# Altium schematic sheet LedModulePower.SchDoc
size B
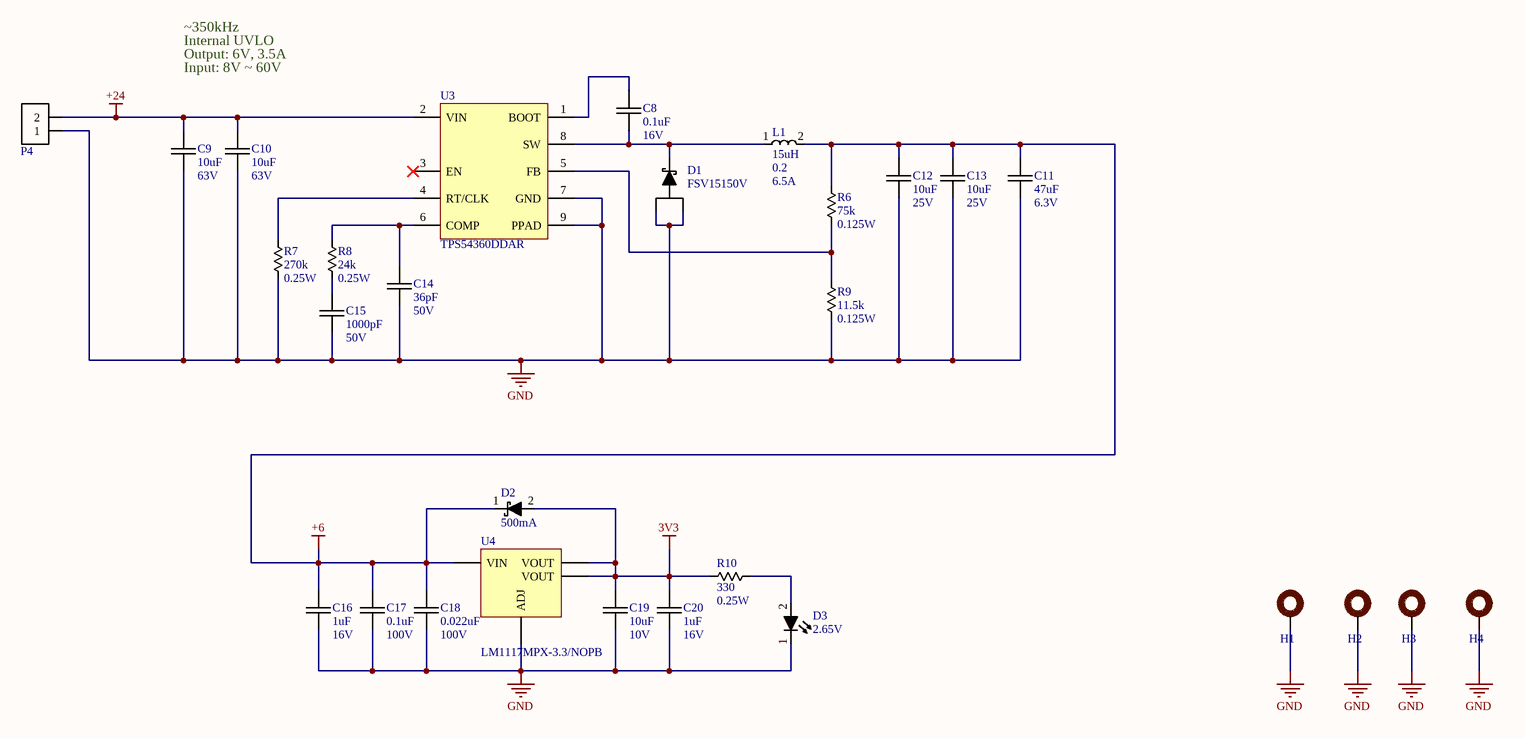
[diagram p0: LedModulePower.SchDoc]

## Parts
C8  Capacitance: 0.1uF  Voltage Rating: 16V  [chip_0603]  (hidden comment: cap_single_np)
C9  Capacitance: 10uF  Voltage Rating: 63V  [chip_1210]  (hidden comment: cap_single_np)
C10  Capacitance: 10uF  Voltage Rating: 63V  [chip_1210]  (hidden comment: cap_single_np)
C11  Capacitance: 47uF  Voltage Rating: 6.3V  [chip_1210]  (hidden comment: cap_single_np)
C12  Capacitance: 10uF  Voltage Rating: 25V  [chip_1206]  (hidden comment: cap_single_np)
C13  Capacitance: 10uF  Voltage Rating: 25V  [chip_1206]  (hidden comment: cap_single_np)
C14  Capacitance: 36pF  Voltage Rating: 50V  [chip_0603]  (hidden comment: cap_single_np)
C15  Capacitance: 1000pF  Voltage Rating: 50V  [chip_0603]  (hidden comment: cap_single_np)
C16  Capacitance: 1uF  Voltage Rating: 16V  [chip_0805]  (hidden comment: cap_single_np)
C17  Capacitance: 0.1uF  Voltage Rating: 100V  [chip_0603]  (hidden comment: cap_single_np)
C18  Capacitance: 0.022uF  Voltage Rating: 100V  [chip_0603]  (hidden comment: cap_single_np)
C19  Capacitance: 10uF  Voltage Rating: 10V  [chip_0805]  (hidden comment: cap_single_np)
C20  Capacitance: 1uF  Voltage Rating: 16V  [chip_0805]  (hidden comment: cap_single_np)
D1  Manufacturer PN: FSV15150V  [TO-277-3]  (hidden comment: diode_sch_A12C3)
D2  Current Rating: 500mA  [sod323_0]  (hidden comment: diode_2)
D3  Forward Voltage: 2.65V  [chip_0603]  (hidden comment: diode_4)
H1  mounting_hole_0  [#8-32_SOCKET_HEAD]  (value not drawn)
H2  mounting_hole_0  [#8-32_SOCKET_HEAD]  (value not drawn)
H3  mounting_hole_0  [#8-32_SOCKET_HEAD]  (value not drawn)
H4  mounting_hole_0  [#8-32_SOCKET_HEAD]  (value not drawn)
L1  Inductance: 15uH  Tolerance: 0.2  Current Rating: 6.5A  [7447709150]  (hidden comment: ind_0)
P4  conn-2x1_0  [TERM_3.50MM_2x1_0]  (value not drawn)
R6  Resistance: 75k  Power Rating: 0.125W  [chip_0805]  (hidden comment: res_single)
R7  Resistance: 270k  Power Rating: 0.25W  [chip_0603]  (hidden comment: res_single)
R8  Resistance: 24k  Power Rating: 0.25W  [chip_0603]  (hidden comment: res_single)
R9  Resistance: 11.5k  Power Rating: 0.125W  [chip_0805]  (hidden comment: res_single)
R10  Resistance: 330  Power Rating: 0.25W  [chip_0603]  (hidden comment: res_single)
U3  Manufacturer PN: TPS54360DDAR  [SO-8_PPAD]  (hidden comment: TPS54360)
U4  Manufacturer PN: LM1117MPX-3.3/NOPB  [sot-223-4]  (hidden comment: LM1117)

## Nets
3V3: C19.1 C20.1 D2.2 R10.1 U4.2(VOUT) U4.4(VOUT)
+6: C11.1 C12.1 C13.1 C16.1 C17.1 C18.1 D2.1 L1.2 R6.1 U4.3(VIN)
+24: C9.1 C10.1 P4.2 U3.2(VIN)
GND: C9.2 C10.2 C11.2 C12.2 C13.2 C14.2 C15.2 C16.2 C17.2 C18.2 C19.2 C20.2 D1.1 D1.2 D3.1 H1.0(A) H2.0(A) H3.0(A) H4.0(A) P4.1 R7.2 R9.2 U3.7(GND) U3.9(PPAD) U4.1(ADJ)
NetC8_1: C8.1 U3.1(BOOT)
NetC8_2: C8.2 D1.3 L1.1 U3.8(SW)
NetC14_1: C14.1 R8.1 U3.6(COMP)
NetC15_1: C15.1 R8.2
NetD3_2: D3.2 R10.2
NetR6_2: R6.2 R9.1 U3.5(FB)
NetR7_1: R7.1 U3.4(RT/CLK)

Not connected (* = marked no-connect by the designer): U3 3(EN)*

## Notes on the sheet
- ~350kHz
- Internal UVLO
- Output: 6V, 3.5A
- Input: 8V ~ 60V

## Library data of the parts
C8 = CAP-00542: CAP, 0.1uF, ±10%, 16V, X7R, 0603; Manufacturer: Murata; Tolerance: ±10%; Part Number: CAP-00542; Type: X7R
C9 C10 = CAP-00554: CAP, 10uF, ±10%, 63V, X7R, 1210; Manufacturer: Samsung Electro-Mechanics; Manufacturer PN: CL32B106KMVNNWE; Tolerance: ±10%; Part Number: CAP-00554; Type: X7R; Cost: 0.81
C11 = CAP-00557: CAP, 47uF, ±20%, 6.3V, X7R, 1210; Manufacturer: KEMET; Manufacturer PN: C1210C476M9RACTU; Tolerance: ±20%; Part Number: CAP-00557; Type: X7R; Cost: $1.08
C12 C13 = CAP-00539: CAP, 10uF, ±10%, 25V, X7R, 1206; Manufacturer: Samsung; Manufacturer PN: CL31B106KAHNNNE; Tolerance: ±10%; Part Number: CAP-00539; Type: X7R
C14 = CAP-00452: CAP, 36pF, ±2%, 50V, C0G, 0603; Manufacturer: Murata; Manufacturer PN: GRM1885C1H360GA01D; Tolerance: ±2%; Part Number: CAP-00452; Type: C0G
C15 = CAP-00465: CAP, 1000pF, ±2%, 50V, C0G, 0603; Manufacturer: Murata; Manufacturer PN: GRM1885C1H102GA01D; Tolerance: ±2%; Part Number: CAP-00465; Type: C0G
C16 C20 = CAP-00107: CAP, 1uF, 10%, 16V, X7R, 0805; Manufacturer: Murata; Manufacturer PN: GRM21BR71C105KA01L; Tolerance: 10%; Part Number: CAP-00107; Type: X7R
C17 = CAP-00530: CAP, 0.1uF, ±10%, 100V, X7R, 0603; Manufacturer: Murata; Manufacturer PN: GRM188R72A104KA35J; Tolerance: ±10%; Part Number: CAP-00530; Type: X7R
C18 = CAP-00524: CAP, 0.022uF, ±10%, 100V, X7R, 0603; Manufacturer: Murata; Manufacturer PN: GRM188R72A223KAC4D; Tolerance: ±10%; Part Number: CAP-00524; Type: X7R
C19 = CAP-00131: CAP, 10uF, 10%, 10V, X7R, 0805; Manufacturer: Murata; Manufacturer PN: GRM21BR71A106KA73L; Tolerance: 10%; Part Number: CAP-00131; Type: X7R
D1 = DIO-00054: Dio, Schottky, 15A, 0.85V, 150V, TO-227; Manufacturer: ON Semi; Current Rating: 15A; Forward Voltage: 0.85V; Type: Schottky; Reverse Breakdown Voltage: 150V; Part Number: DIO-00054; Cost: 0.82
D2 = DIO-00000: Dio Shtky, 500mA, 0.62V, 30V, SOD-323; Manufacturer: ON Semi; Manufacturer PN: NSR0530HT1G; Forward Voltage: 620mV; Type: Schottky; Reverse Breakdown Voltage: 30V; Part Number: DIO-00000
D3 = DIO-00049: LED, Blue, 0603, Low current, HELI2 Series; Manufacturer: Kingbright; Manufacturer PN: APT1608LVBC/D; Reverse Breakdown Voltage: 5V; Current Rating: 30mA; Power Rating: 120mW; Type: LED; Part Number: DIO-00049; Cost: 0.58
H1-H4 = MISC-00027: #8-32 Mounting Hole for Socket Head Cap Screw; Part Number: MISC-00027
L1 = MAG-00090: Ind, 15uH, 0.2, 6.5A, 7447709150; Manufacturer: Wurth; DCR: 26 mOhm; Part Number: MAG-00090; Manufacturer PN: 7447709150; Cost: 2.41
P4 = CONN-00023: Term Blk, 2 Pos, 16A, 3.5mm Pitch; Manufacturer: Phoenix Contact; Manufacturer PN: 1861933; Positions per level: 2; Levels: 1; Current: 16; Part Number: CONN-00023; Type: Terminal Block; Cost: 0.79
R6 = RES-00554: RES SMD 75K OHM 1% 1/8W 0805; Manufacturer: Rohm Semiconductor; Manufacturer PN: KTR10EZPF7502; Tolerance: 1%; Part Number: RES-00554
R7 = RES-00405: RES SMD 270K OHM 1% 1/4W 0603; Manufacturer: Panasonic; Manufacturer PN: ERJ-PA3F2703V; Tolerance: 1%; Part Number: RES-00405
R8 = RES-00399: RES SMD 24K OHM 1% 1/4W 0603; Manufacturer: Panasonic; Manufacturer PN: ERJ-PA3F2402V; Tolerance: 1%; Part Number: RES-00399
R9 = RES-00309: RES SMD 11.5K OHM 1% 1/8W 0805; Manufacturer: Rohm Semiconductor; Manufacturer PN: KTR10EZPF1152; Tolerance: 1%; Part Number: RES-00309
R10 = RES-00221: RES SMD 330 OHM 1% 1/4W 0603; Manufacturer: Panasonic; Manufacturer PN: ERJ-PA3F3300V; Tolerance: 1%; Part Number: RES-00221
U3 = PWREG-00017: REG, SW Buck Adj, 3.5A, 4.5-60V, 2.5MHz; Manufacturer: TI; Voltage Range Out: 0.8 - 58.8V; Max Current: 4.5A; Frequency: 100kHz-2.5MHz; Reg Type: SW Buck; Part Number: PWREG-00017; Voltage Range In: 4.5 - 60V; Fixed/Adj: Adj; Cost: 5.11
U4 = PWREG-00018: REG, Linear, Fixed 3V3, 800mA, SOT-223; Manufacturer: TI; Voltage Range In: 4.5 - 15V; Voltage Range Out: 3.3V; Part Number: PWREG-00018; Max Current: 800mA; Reg Type: Linear; Fixed/Adj: Fixed; Cost: 1.14